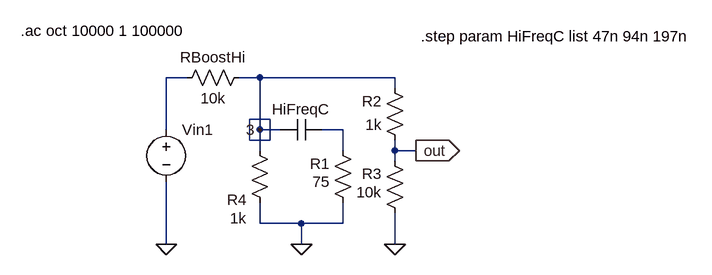
[diagram p0: schematic HighCut.asc]
HighCut.asc, the LTspice schematic file:
Version 4
SHEET 1 880 680
WIRE -48 32 -80 32
WIRE 64 32 32 32
WIRE 272 32 64 32
WIRE 272 48 272 32
WIRE 80 96 48 96
WIRE -80 112 -80 32
WIRE 64 112 64 32
WIRE 96 112 64 112
WIRE 192 112 160 112
WIRE 48 128 48 96
WIRE 80 128 80 96
WIRE 80 128 48 128
WIRE 64 144 64 112
WIRE 192 144 192 112
WIRE 272 144 272 128
WIRE 304 144 272 144
WIRE 272 160 272 144
WIRE 64 256 64 224
WIRE 128 256 64 256
WIRE 192 256 192 224
WIRE 192 256 128 256
WIRE -80 288 -80 192
WIRE 128 288 128 256
WIRE 272 288 272 240
FLAG 64 112 3
FLAG 128 288 0
FLAG -80 288 0
FLAG 304 144 out
IOPIN 304 144 Out
FLAG 272 288 0
SYMBOL cap 160 96 R90
WINDOW 0 0 32 VBottom 2
WINDOW 3 32 32 Invisible 2
SYMATTR InstName HiFreqC
SYMATTR Value {HiFreqC}
SYMBOL res 208 240 R180
WINDOW 0 36 76 Left 2
WINDOW 3 36 48 Left 2
SYMATTR InstName R1
SYMATTR Value 75
SYMBOL res 80 240 R180
WINDOW 0 36 20 Left 2
WINDOW 3 36 -8 Left 2
SYMATTR InstName R4
SYMATTR Value 1k
SYMBOL res 48 16 R90
WINDOW 0 0 56 VBottom 2
WINDOW 3 32 56 VTop 2
SYMATTR InstName RBoostHi
SYMATTR Value 10k
SYMBOL res 288 144 R180
WINDOW 0 36 76 Left 2
WINDOW 3 36 40 Left 2
SYMATTR InstName R2
SYMATTR Value 1k
SYMBOL voltage -80 96 R0
WINDOW 3 24 96 Invisible 2
SYMATTR Value ""
SYMATTR Value2 AC 1
SYMATTR InstName Vin1
SYMBOL res 288 256 R180
WINDOW 0 36 76 Left 2
WINDOW 3 36 48 Left 2
SYMATTR InstName R3
SYMATTR Value 10k
TEXT -304 -40 Left 2 !.ac oct 10000 1 100000
TEXT 312 -32 Left 2 !.step param HiFreqC list 47n 94n 197n

The netlist it stands for:
* HighCut.asc
C§HiFreqC N003 3 {HiFreqC}
R1 0 N003 75
R4 0 3 1k
RBoostHi 3 N001 10k
R2 out 3 1k
Vin1 N001 0 AC 1
R3 0 out 10k
.ac oct 10000 1 100000
.step param HiFreqC list 47n 94n 197n
.backanno
.end